# Altium project USB-UART-ISO-CP2102.PrjPcb (part 2 of 2)

## Sheet 6_Connector.SchDoc: Connector
size A4; ApprovedBy: Alcatraz; CheckedBy: Alcatraz; Author: Alcatraz; CompanyName: DHNLAB; DrawnBy: Alcatraz; Engineer: Alcatraz; Organization: DHNLAB PVT LTD; Address1: DHANBAD; Address2: JHARKHAND; Address3: INDIA; Address4: ASIA; DocumentNumber: 6; Revision: 1.0; SheetNumber: 6; SheetTotal: 7; ProjectTitle: USB-UART-ISO-CP2102
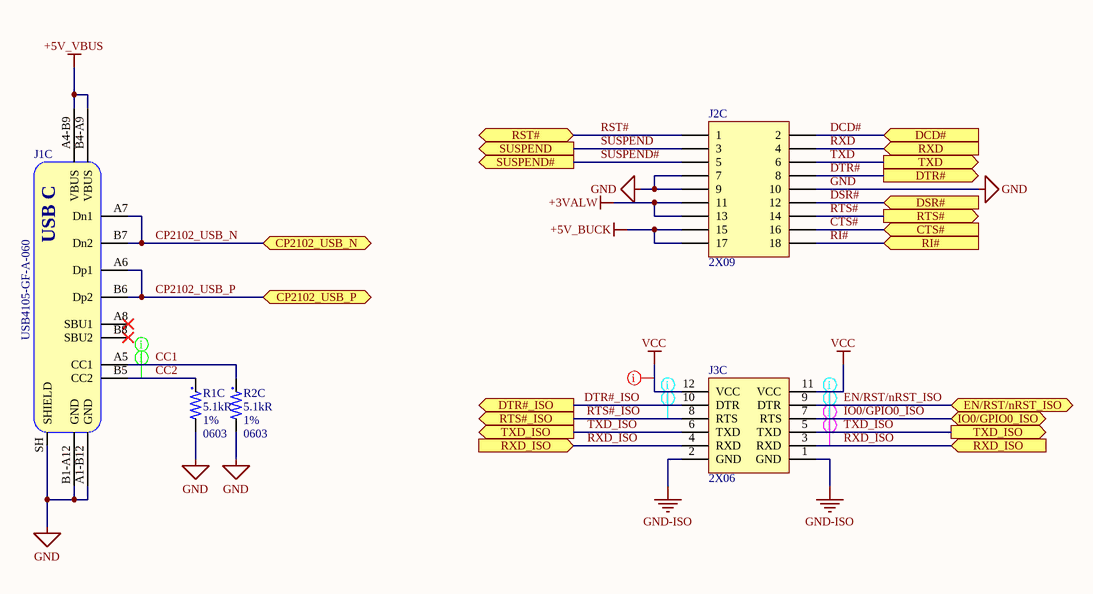
[diagram p5: 6_Connector.SchDoc]

### Parts
J1C  USB4105-GF-A-060  [USB-Type-C-16-Pin-SMT]
J2C  2X09  [PinHeader_2x09_P2.54mm_Vertical]
J3C  2X06  [PinHeader_2x06_P2.54mm_Vertical]
R1C  value 5.1kR  Tolerance: 1%  Case/Package: 0603  [R0603-MFG]  (hidden comment: CRCW06035K10FKEA)
R2C  value 5.1kR  Tolerance: 1%  Case/Package: 0603  [R0603-MFG]  (hidden comment: CRCW06035K10FKEA)

### Ports
CP2102_USB_N (bidir), CP2102_USB_P (bidir), CTS# (in), DCD# (in), DSR# (in), DTR# (out), DTR#_ISO (out), EN/RST/nRST_ISO (bidir), IO0/GPIO0_ISO (bidir), RI# (in), RST# (bidir), RTS# (out), RTS#_ISO (out), RXD (in), RXD_ISO (in), SUSPEND (out), SUSPEND# (out), TXD (out), TXD_ISO (out)

### Nets
+3VALW: J2C.11 J2C.13
+5V_BUCK: J2C.15 J2C.17
+5V_VBUS: J1C.A4-B9(VBUS) J1C.B4-A9(VBUS)
GND: J1C.A1-B12(GND) J1C.B1-A12(GND) J1C.SH(SHIELD) J2C.7 J2C.9 J2C.10 R1C.2 R2C.2
GND-ISO: J3C.1(GND) J3C.2(GND)
VCC: J3C.11(VCC) J3C.12(VCC)
CC1: J1C.A5(CC1) R2C.1
CC2: J1C.B5(CC2) R1C.1
CP2102_USB_N: J1C.A7(Dn1) J1C.B7(Dn2) ; port CP2102_USB_N
CP2102_USB_P: J1C.A6(Dp1) J1C.B6(Dp2) ; port CP2102_USB_P
CTS#: J2C.16 ; port CTS#
DCD#: J2C.2 ; port DCD#
DSR#: J2C.12 ; port DSR#
DTR#: J2C.8 ; port DTR#
DTR#_ISO: J3C.10(DTR) ; port DTR#_ISO
EN/RST/nRST_ISO: J3C.9(DTR) ; port EN/RST/nRST_ISO
IO0/GPIO0_ISO: J3C.7(RTS) ; port IO0/GPIO0_ISO
RI#: J2C.18 ; port RI#
RST#: J2C.1 ; port RST#
RTS#: J2C.14 ; port RTS#
RTS#_ISO: J3C.8(RTS) ; port RTS#_ISO
RXD: J2C.4 ; port RXD
RXD_ISO: J3C.3(RXD) J3C.4(RXD) ; port RXD_ISO
SUSPEND: J2C.3 ; port SUSPEND
SUSPEND#: J2C.5 ; port SUSPEND#
TXD: J2C.6 ; port TXD
TXD_ISO: J3C.5(TXD) J3C.6(TXD) ; port TXD_ISO

Not connected (* = marked no-connect by the designer): J1C A8(SBU1)* B8(SBU2)*

### Layout directives
net class Signal; net class Digital_Signal_Low_Speed: CC1, CC2
net class Power; net class PowerRails_LowVoltage_DC: VCC
net class Signal_50_ohm; net class Digital_Signal_Low_Speed; net class Digital_Signal_RS232_ISO: RXD_ISO, TXD_ISO
net class Signal; net class Digital_Signal_Low_Speed; net class Digital_Signal_RS232_ISO: DTR#_ISO, EN/RST/nRST_ISO, IO0/GPIO0_ISO, RTS#_ISO

### Notes on the sheet
- Title:
- Author:
- Approved:
- Size:
- Date:
- Git Hash:
- A4
- Prj:
- SW Version:
- Variant:
- Edited:
- PUBLIC
- File:
- (in symbol USB-Type-C-16-Pin-SMT) USB C

### Library data of the parts
J1C = USB-Type-C-16-Pin-SMT: USB Connector Type C SMT 16 Pin / (Power pins joints = 12 pins); Manufacturer: GCT; Manufacturer Part Number: USB4105-GF-A-060
J2C = PinHeader 2X09 DU
J3C = UART_2x06_P2.54mm_V2
R1C R2C = 5.1K: SMD Chip Resistor, 5.1 kOhm, ± 1%, 100 mW, 0603 [1608 Metric], Thick Film, General Purpose; Manufacturer: Vishay; Temperature Coefficient: 100ppm/°C; Max Power Dissipation: 100mW; Voltage Rating: 75V; Supplier 1: Mouser; Manufacturer Part Number: CRCW06035K10FKEA; RoHS: Yes; Category: Chip SMD Resistors; Stock 1: 43654; Pricing 1: 1=0.1, 10=0.034, 50=0.034, 100=0.014, 1000=0.008, 10000=0.004 (USD); Case Code (Imperial): 0603; Case Code (Metric): 1608; Weight: 7.1E-05oz; Contact Plating: Tin; Min Operating Temperature: -55°C; Max Operating Temperature: 155°C; Packaging: Tape and Reel; Series: CRCW; Number of Terminations: 2; Features: Automotive AEC-Q200; Power Rating: 100mW; Voltage Rating (DC): 75V; Package Quantity: 5000; Termination: SMD/SMT; Resistor Type: Thick Film; Construction: Rectangular; Resistance Tolerance: 1%; Technology: THICK FILM; Length: 1.55mm; Width: 0.85mm; Height: 0.45mm; Depth: 0.85mm; Radiation Hardening: No; RoHS Compliant: Yes; Lead Free: 5697LeadFree; Military Standard: Not; Reach SVHC Compliant: Unknown; ComponentLink1URL: https://datasheet.ciiva.com/11809/0900766b80d98afc-11809935.pdf?src-supplier=Rs; ComponentLink1Description: https://datasheet.ciiva.com/11809/0900766b80d98afc-11809935.pdf?src-supplier=Rs; ComponentLink2URL: https://datasheet.ciiva.com/7690/1720486-7690873.pdf?src-supplier=Element14; ComponentLink2Description: https://datasheet.ciiva.com/7690/1720486-7690873.pdf?src-supplier=Element14; ComponentLink3URL: https://datasheet.ciiva.com/15159/getdatasheetpartid-32793-15159338.pdf?src-supplier=Verical; ComponentLink3Description: https://datasheet.ciiva.com/15159/getdatasheetpartid-32793-15159338.pdf?src-supplier=Verical; ComponentLink4URL: https://datasheet.ciiva.com/26314/fld-crcw-e3-data-en-26314742.pdf?src-supplier=Distrelec; ComponentLink4Description: https://datasheet.ciiva.com/26314/fld-crcw-e3-data-en-26314742.pdf?src-supplier=Distrelec; ComponentLink5URL: https://datasheet.ciiva.com/7690/1697337-7690728.pdf?src-supplier=Element14; ComponentLink5Description: https://datasheet.ciiva.com/7690/1697337-7690728.pdf?src-supplier=Element14; ComponentLink6URL: https://datasheet.ciiva.com/3257/dcrcwe3-3257758.pdf?src-supplier=Avnet; ComponentLink6Description: https://datasheet.ciiva.com/3257/dcrcwe3-3257758.pdf?src-supplier=Avnet; ComponentLink7URL: https://datasheet.ciiva.com/16226/dcrcwe3-16226862.pdf?src-supplier=Future+Electronics; ComponentLink7Description: https://datasheet.ciiva.com/16226/dcrcwe3-16226862.pdf?src-supplier=Future+Electronics; Supplier Part Number 1: 71-CRCW0603-5.1K-E3

## Sheet 7_MountingHoles.SchDoc: MountingHoles
size A4; ApprovedBy: Alcatraz; CheckedBy: Alcatraz; Author: Alcatraz; CompanyName: DHNLAB; DrawnBy: Alcatraz; Engineer: Alcatraz; Organization: DHNLAB PVT LTD; Address1: DHANBAD; Address2: JHARKHAND; Address3: INDIA; Address4: ASIA; DocumentNumber: 7; Revision: 1.0; SheetNumber: 7; SheetTotal: 7; ProjectTitle: USB-UART-ISO-CP2102
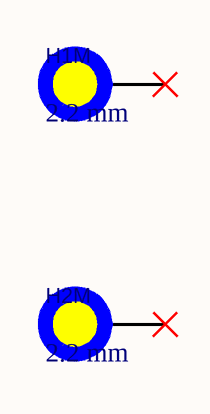
[diagram p6: 7_MountingHoles.SchDoc]

### Parts
H1M  2.2 mm  [MountingHole_2.2mm_M2_Pad_Via_Mask]  (no BOM)
H2M  2.2 mm  [MountingHole_2.2mm_M2_Pad_Via_Mask]  (no BOM)

### Nets

Not connected (* = marked no-connect by the designer): H1M 1*; H2M 1*

### Notes on the sheet
- Title:
- Author:
- Approved:
- Size:
- Date:
- Git Hash:
- A4
- Prj:
- SW Version:
- Variant:
- Edited:
- PUBLIC
- File:

### Library data of the parts
H1M H2M = MountingHole_Pad_2.2mm(M2): ki_description: Mounting Hole with connection; ki_fp_filters: MountingHole*Pad*; Supplier: ~; ki_keywords: mounting hole; Value: 2.2 mm

## Nets that join several sheets
+3VALW: 2_LDO (C3L.1 R0L.1 R4L.1 U1L.5), 3_USB_TO_UART (C3U.1 R1U.1 U1U.6), 4_Digital_Isolator (C1I.1 C2I.1 U1I.1), 6_Connector (J2C.11 J2C.13)
+5V_BUCK: 1_Power_Path (F1P.2), 2_LDO (C1L.1 C2L.1 R3L.1 U1L.1), 3_USB_TO_UART (C1U.1 C2U.1 U1U.7 U1U.8), 6_Connector (J2C.15 J2C.17)
+5V_VBUS: 1_Power_Path (C1P.1 Q1P.1-2-5-6-7), 3_USB_TO_UART (D1U.5), 6_Connector (J1C.A4-B9 J1C.B4-A9)
GND: 1_Power_Path (C1P.2 R1P.2), 2_LDO (6 pins), 3_USB_TO_UART (8 pins), 4_Digital_Isolator (C1I.2 C2I.2 U1I.2 U1I.8), 6_Connector (8 pins)
GND-ISO: 4_Digital_Isolator (5 pins), 5_Auto_Reset (C1R.2 C2R.2), 6_Connector (J3C.1 J3C.2)
VCC: 4_Digital_Isolator (C3I.1 C4I.1 C5I.1 U1I.16), 5_Auto_Reset (R2R.1 R3R.1), 6_Connector (J3C.11 J3C.12)
CP2102_USB_N: 3_USB_TO_UART (D1U.3 U1U.5), 6_Connector (J1C.A7 J1C.B7)
CP2102_USB_P: 3_USB_TO_UART (D1U.4 U1U.4), 6_Connector (J1C.A6 J1C.B6)
CTS#: 3_USB_TO_UART (U1U.23), 6_Connector (J2C.16)
DCD#: 3_USB_TO_UART (U1U.1), 6_Connector (J2C.2)
DSR#: 3_USB_TO_UART (U1U.27), 6_Connector (J2C.12)
DTR#: 3_USB_TO_UART (U1U.28), 4_Digital_Isolator (U1I.3), 6_Connector (J2C.8)
DTR#_ISO: 4_Digital_Isolator (U1I.14), 5_Auto_Reset (Q2R.2 R1R.1), 6_Connector (J3C.10)
EN/RST/nRST_ISO: 5_Auto_Reset (C2R.1 Q1R.3 R3R.2), 6_Connector (J3C.9)
IO0/GPIO0_ISO: 5_Auto_Reset (C1R.1 Q2R.3 R2R.2), 6_Connector (J3C.7)
RI#: 3_USB_TO_UART (U1U.2), 6_Connector (J2C.18)
RST#: 3_USB_TO_UART (R1U.2 U1U.9), 6_Connector (J2C.1)
RTS#: 3_USB_TO_UART (U1U.24), 4_Digital_Isolator (U1I.4), 6_Connector (J2C.14)
RTS#_ISO: 4_Digital_Isolator (U1I.13), 5_Auto_Reset (Q1R.2 R4R.1), 6_Connector (J3C.8)
RXD: 3_USB_TO_UART (U1U.25), 4_Digital_Isolator (U1I.6), 6_Connector (J2C.4)
RXD_ISO: 4_Digital_Isolator (U1I.11), 6_Connector (J3C.3 J3C.4)
SUSPEND: 3_USB_TO_UART (U1U.12), 6_Connector (J2C.3)
SUSPEND#: 3_USB_TO_UART (R2U.1 U1U.11), 6_Connector (J2C.5)
TXD: 3_USB_TO_UART (U1U.26), 4_Digital_Isolator (U1I.5), 6_Connector (J2C.6)
TXD_ISO: 4_Digital_Isolator (U1I.12), 6_Connector (J3C.5 J3C.6)